# EAGLE schematic ES_Daisy_Seed2_DFM_EVAL_EURO_Rev2 (EAGLE 9.6.2)
Assembly variants: OG_AUDIO_BB

## Sheet 1 of 5
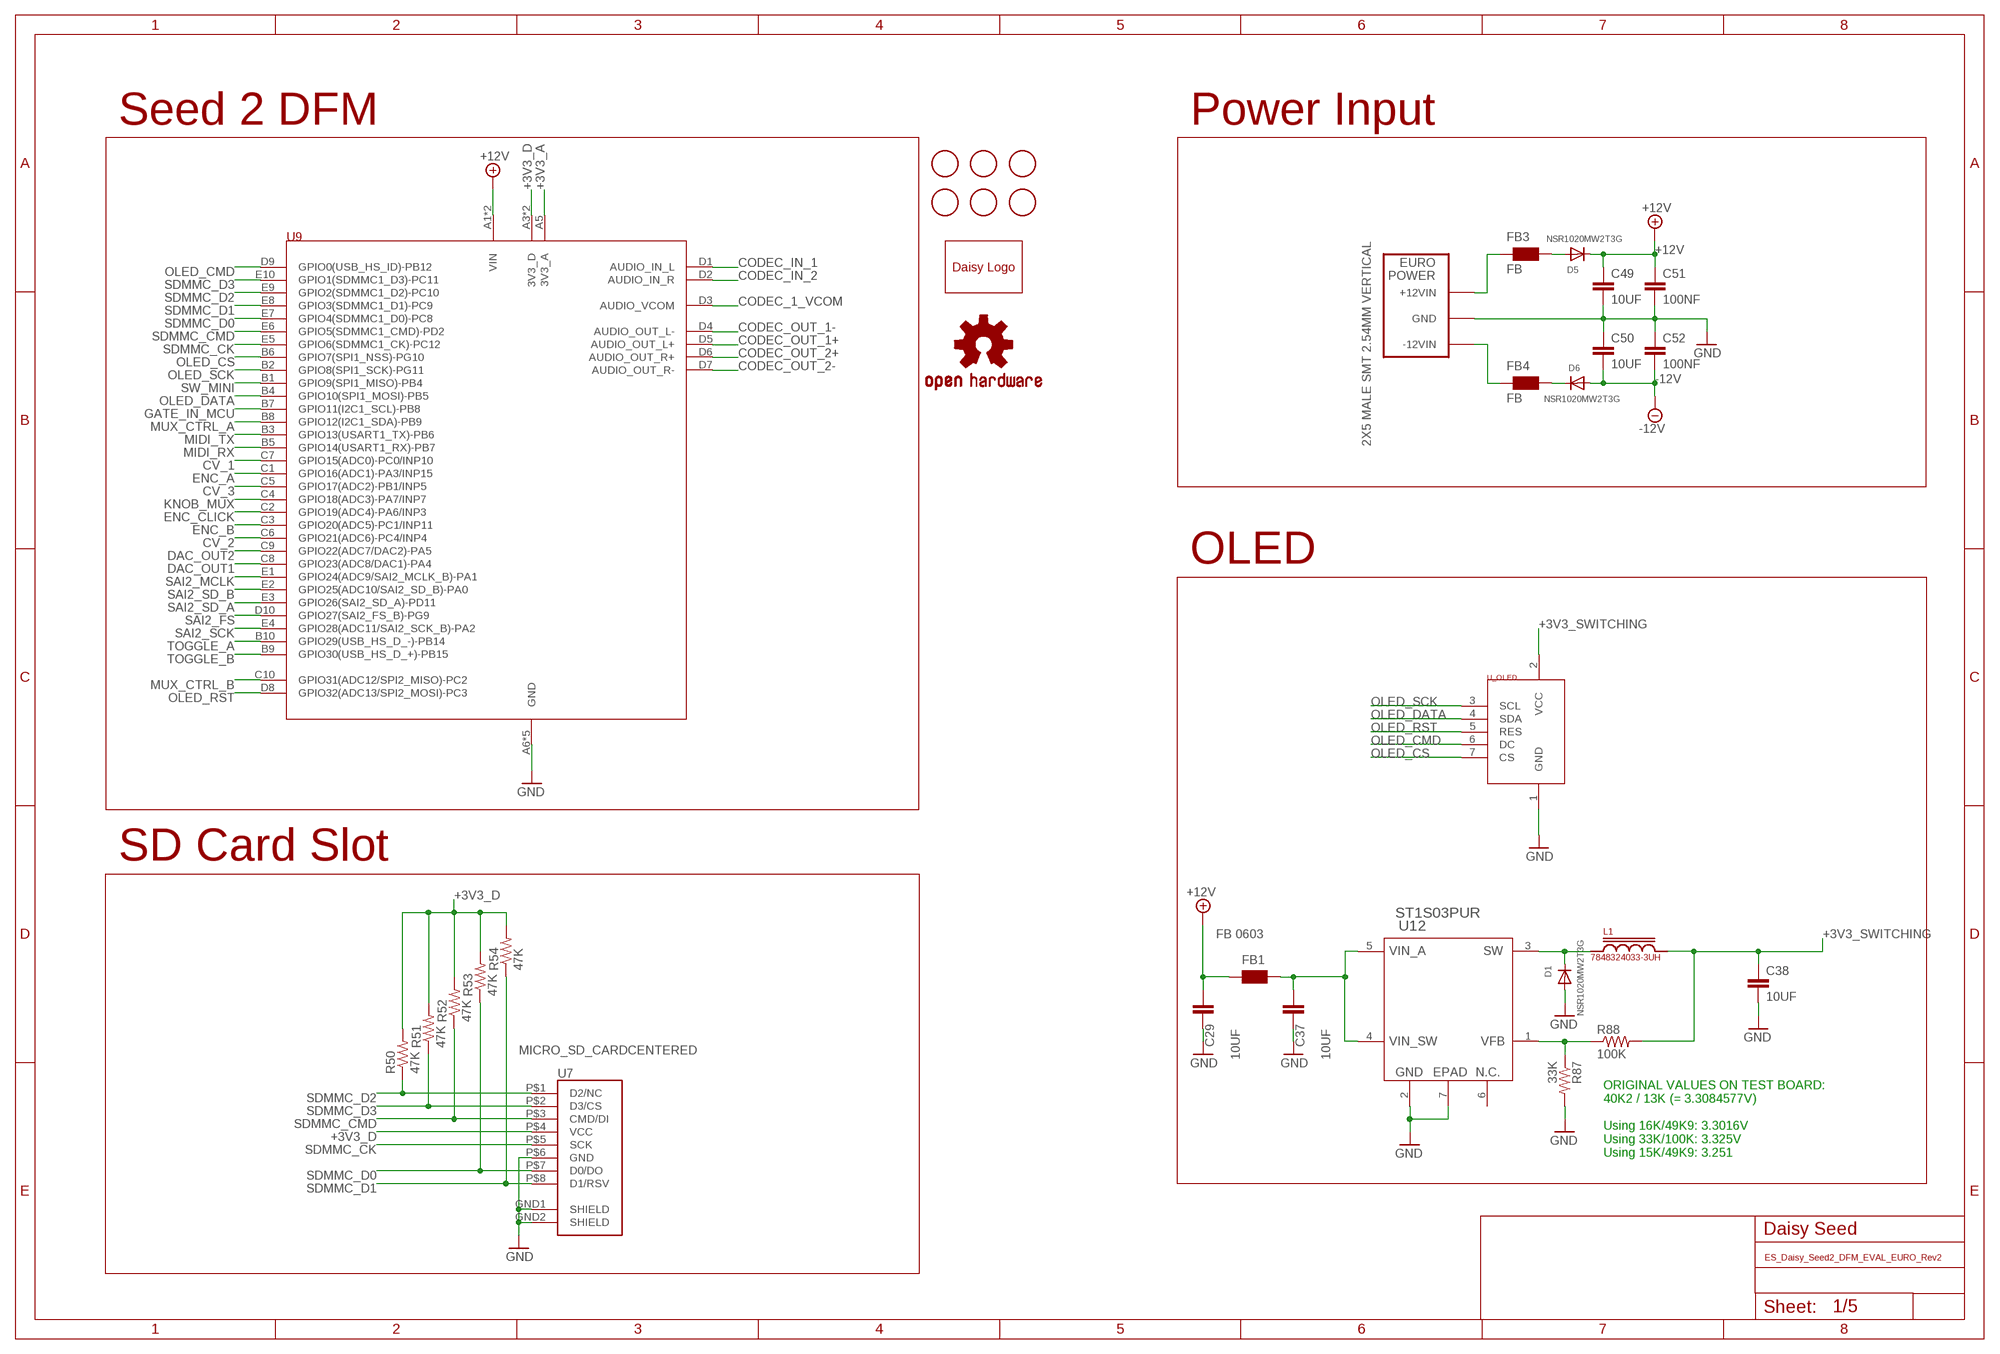
[diagram p0: schematic, sheet 1]

### Parts
C29  10UF  C-EUC0805  [C0805]  (not fitted in variant OG_AUDIO_BB)
C37  10UF  C-EUC0805  [C0805]
C38  10UF  C-EUC0805  [C0805]
C49  10UF  C-EUC0805  [C0805]
C50  10UF  C-EUC0805  [C0805]
C51  100NF  C-EUC0402  [C0402]
C52  100NF  C-EUC0402  [C0402]
D1  NSR1020MW2T3G  DIODE_SOD-323F  [SOD-323F]
D5  NSR1020MW2T3G  DIODE_SOD-323F  [SOD-323F]
D6  NSR1020MW2T3G  DIODE_SOD-323F  [SOD-323F]
FB1  FB 0603  FERRITE_BEAD_0603  [WUERTH-ELEKTRONIK_0603]  (not fitted in variant OG_AUDIO_BB)
FB3  FB  FERRITE_BEAD_0603  [WUERTH-ELEKTRONIK_0603]
FB4  FB  FERRITE_BEAD_0603  [WUERTH-ELEKTRONIK_0603]
FD1  FIDUCIAL  [FIDUCIAL_1MM]
FD2  FIDUCIAL  [FIDUCIAL_1MM]
FD3  FIDUCIAL  [FIDUCIAL_1MM]
FD4  FIDUCIAL  [FIDUCIAL_1MM]
FD5  FIDUCIAL  [FIDUCIAL_1MM]
FD6  FIDUCIAL  [FIDUCIAL_1MM]
L1  7848324033-3UH  INDUCTOR1008  [I1008]
LOGO1  OSHW-LOGO  [OSHW-LOGO-L_TEXT]
P1  2X5 MALE SMT 2.54MM VERTICAL  EURORACK_POWERSMT  [EURORACK_POWER_SMT]
R50  47K  R-US_R0603  [R0603]
R51  47K  R-US_R0603  [R0603]
R52  47K  R-US_R0603  [R0603]
R53  47K  R-US_R0603  [R0603]
R54  47K  R-US_R0603  [R0603]
R87  33K  R-US_R0603  [R0603]
R88  100K  R-US_R0402  [R0402]
U7  MICRO_SD_CARDCENTERED  [VERT_MICROSD_CENTERED]
U9  ES_DAISY_SEED2_DFM_REV1""  [ES_DAISY_SEED2_DFM_REV1]
U12  ST1S03PUR  [DFN06_3X3_STM]
U$5  DAISYLOGO  [ES_DAISY_LOGO_1]
U_OLED  OLED_DISPLAY  [ER-OLEDM015-2]

### Nets
+3V3_A: U9.A5(3V3_A) ; also sheet 2,3
+3V3_D: R50.2 R51.2 R52.2 R53.2 R54.2 U7.P$4(VCC) U9.A3(3V3_D) U9.A4(3V3_D) ; also sheet 2,3,4
+3V3_SWITCHING: C38.1 L1.2 R88.2 U_OLED.2(VCC)
+12V: C29.1 C49.1 C51.1 D5.C FB1.1 U9.A1(VIN) U9.A2(VIN) ; also sheet 3,4
-12V: C50.2 C52.2 D6.A ; also sheet 3,4
CODEC_1_VCOM: U9.D3(AUDIO_VCOM) ; also sheet 5
CODEC_IN_1: U9.D1(AUDIO_IN_L) ; also sheet 5
CODEC_IN_2: U9.D2(AUDIO_IN_R) ; also sheet 5
CODEC_OUT_1+ [CODEC]: U9.D5(AUDIO_OUT_L+) ; also sheet 4
CODEC_OUT_1- [CODEC]: U9.D4(AUDIO_OUT_L-) ; also sheet 4
CODEC_OUT_2+ [CODEC]: U9.D6(AUDIO_OUT_R+) ; also sheet 4
CODEC_OUT_2- [CODEC]: U9.D7(AUDIO_OUT_R-) ; also sheet 4
CV_1: U9.C7(GPIO15(ADC0)-PC0/INP10) ; also sheet 3
CV_2: U9.C6(GPIO21(ADC6)-PC4/INP4) ; also sheet 3
CV_3: U9.C5(GPIO17(ADC2)-PB1/INP5) ; also sheet 3
DAC_OUT1: U9.C8(GPIO23(ADC8/DAC1)-PA4) ; also sheet 3
DAC_OUT2: U9.C9(GPIO22(ADC7/DAC2)-PA5) ; also sheet 3
ENC_A: U9.C1(GPIO16(ADC1)-PA3/INP15) ; also sheet 2
ENC_B: U9.C3(GPIO20(ADC5)-PC1/INP11) ; also sheet 2
ENC_CLICK: U9.C2(GPIO19(ADC4)-PA6/INP3) ; also sheet 2
GATE_IN_MCU: U9.B7(GPIO11(I2C1_SCL)-PB8) ; also sheet 3
GND: C29.2 C37.2 C38.2 C49.2 C50.1 C51.2 C52.1 D1.A P1.GND1A(GND) P1.GND1B(GND) P1.GND2A(GND) P1.GND2B(GND) P1.GND3A(GND) P1.GND3B(GND) R87.2 U7.GND1(SHIELD) U7.GND2(SHIELD) U7.P$6(GND) U9.A6(GND) U9.A7(GND) U9.A8(GND) U9.A9(GND) U9.A10(GND) U12.2(GND) U12.7(EPAD) U_OLED.1(GND) ; also sheet 2,3,4,5
KNOB_MUX: U9.C4(GPIO18(ADC3)-PA7/INP7) ; also sheet 3
MIDI_RX: U9.B5(GPIO14(USART1_RX)-PB7) ; also sheet 3
MIDI_TX: U9.B3(GPIO13(USART1_TX)-PB6) ; also sheet 2
MUX_CTRL_A: U9.B8(GPIO12(I2C1_SDA)-PB9) ; also sheet 3
MUX_CTRL_B: U9.C10(GPIO31(ADC12/SPI2_MISO)-PC2) ; also sheet 3
N$51: R87.1 R88.1 U12.1(VFB)
N$55: FB3.1 P1.P12VA(+12VIN) P1.P12VB(+12VIN)
N$59: D5.A FB3.2
N$63: D6.C FB4.2
N$67: FB4.1 P1.N12VA(-12VIN) P1.N12VB(-12VIN)
N$68: D1.C L1.1 U12.3(SW)
N$69: C37.1 FB1.2 U12.4(VIN_SW) U12.5(VIN_A)
OLED_CMD: U9.D9(GPIO0(USB_HS_ID)-PB12) U_OLED.6(DC)
OLED_CS: U9.B6(GPIO7(SPI1_NSS)-PG10) U_OLED.7(CS)
OLED_DATA: U9.B4(GPIO10(SPI1_MOSI)-PB5) U_OLED.4(SDA)
OLED_RST: U9.D8(GPIO32(ADC13/SPI2_MOSI)-PC3) U_OLED.5(RES)
OLED_SCK: U9.B2(GPIO8(SPI1_SCK)-PG11) U_OLED.3(SCL)
SAI2_FS [SAI]: U9.D10(GPIO27(SAI2_FS_B)-PG9) ; also sheet 4
SAI2_MCLK [SAI]: U9.E1(GPIO24(ADC9/SAI2_MCLK_B)-PA1) ; also sheet 4
SAI2_SCK [SAI]: U9.E4(GPIO28(ADC11/SAI2_SCK_B)-PA2) ; also sheet 4
SAI2_SD_A [SAI]: U9.E3(GPIO26(SAI2_SD_A)-PD11) ; also sheet 4
SAI2_SD_B: U9.E2(GPIO25(ADC10/SAI2_SD_B)-PA0) ; also sheet 4
SDMMC_CK: U7.P$5(SCK) U9.E5(GPIO6(SDMMC1_CK)-PC12)
SDMMC_CMD: R52.1 U7.P$3(CMD/DI) U9.E6(GPIO5(SDMMC1_CMD)-PD2)
SDMMC_D0: R53.1 U7.P$7(D0/DO) U9.E7(GPIO4(SDMMC1_D0)-PC8)
SDMMC_D1: R54.1 U7.P$8(D1/RSV) U9.E8(GPIO3(SDMMC1_D1)-PC9)
SDMMC_D2: R50.1 U7.P$1(D2/NC) U9.E9(GPIO2(SDMMC1_D2)-PC10)
SDMMC_D3: R51.1 U7.P$2(D3/CS) U9.E10(GPIO1(SDMMC1_D3)-PC11)
SW_MINI: U9.B1(GPIO9(SPI1_MISO)-PB4) ; also sheet 2
TOGGLE_A: U9.B10(GPIO29(USB_HS_D_-)-PB14) ; also sheet 2
TOGGLE_B: U9.B9(GPIO30(USB_HS_D_+)-PB15) ; also sheet 2
Unconnected: U12.6(N.C.)

### Notes on the sheet
- Seed 2 DFM | Power Input
- OLED
- SD Card Slot
- ORIGINAL VALUES ON TEST BOARD:
  40K2 / 13K (= 3.3084577V)
  
  Using 16K/49K9: 3.3016V
  Using 33K/100K: 3.325V
  Using 15K/49K9: 3.251
- Daisy Seed

## Sheet 2 of 5
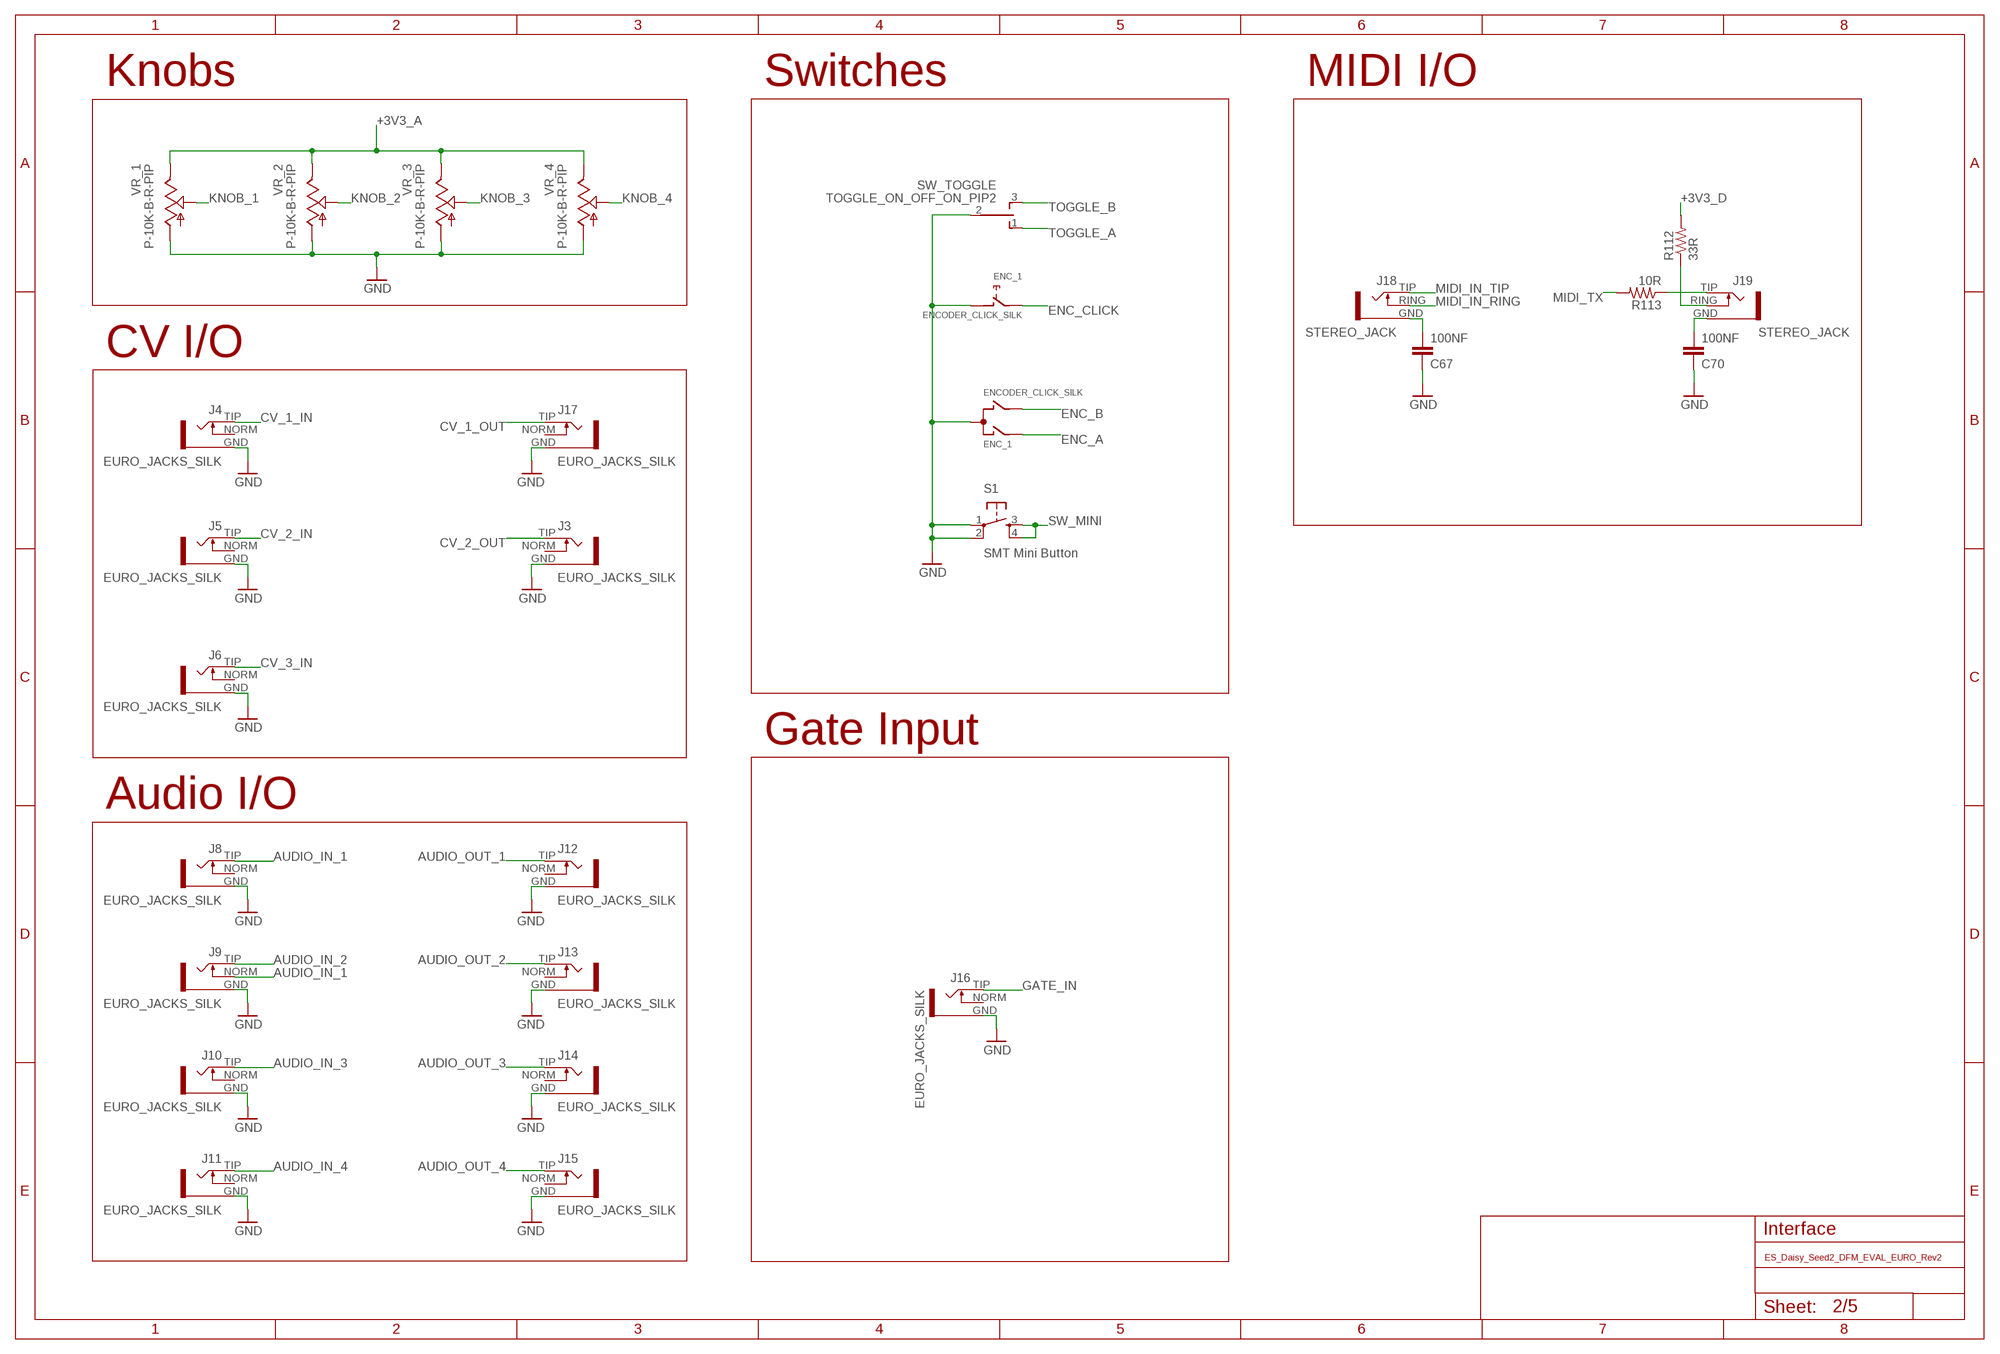
[diagram p1: schematic, sheet 2]

### Parts
C67  100NF  C-EUC0402  [C0402]
C70  100NF  C-EUC0402  [C0402]
ENC_1  ENCODER_CLICK_SILK  [PEC11_SILK]
J3  EURO_JACKS_SILK  [S_JACK_SILK]
J4  EURO_JACKS_SILK  [S_JACK_SILK]
J5  EURO_JACKS_SILK  [S_JACK_SILK]
J6  EURO_JACKS_SILK  [S_JACK_SILK]
J8  EURO_JACKS_SILK  [S_JACK_SILK]
J9  EURO_JACKS_SILK  [S_JACK_SILK]
J10  EURO_JACKS_SILK  [S_JACK_SILK]
J11  EURO_JACKS_SILK  [S_JACK_SILK]
J12  EURO_JACKS_SILK  [S_JACK_SILK]
J13  EURO_JACKS_SILK  [S_JACK_SILK]
J14  EURO_JACKS_SILK  [S_JACK_SILK]
J15  EURO_JACKS_SILK  [S_JACK_SILK]
J16  EURO_JACKS_SILK  [S_JACK_SILK]
J17  EURO_JACKS_SILK  [S_JACK_SILK]
J18  STEREO_JACK  [STEREO_JACK_3.5MM]
J19  STEREO_JACK  [STEREO_JACK_3.5MM]
R112  33R  R-US_R0603  [R0603]
R113  10R  R-US_R0603  [R0603]
S1  SMT Mini Button  TAC_SWITCH_SMT  [TL3301SPF160QJ]
SW_TOGGLE  TOGGLE_ON_OFF_ON_PIP2  [TOGGLE_SILK_PIP3]
VR_1  P-10K-B-R-PIP  POT_9MM_SNAP-IN__SILK_PIP  [9MM_SNAP-IN_POT_SILK_PIP]
VR_2  P-10K-B-R-PIP  POT_9MM_SNAP-IN__SILK_PIP  [9MM_SNAP-IN_POT_SILK_PIP]
VR_3  P-10K-B-R-PIP  POT_9MM_SNAP-IN__SILK_PIP  [9MM_SNAP-IN_POT_SILK_PIP]
VR_4  P-10K-B-R-PIP  POT_9MM_SNAP-IN__SILK_PIP  [9MM_SNAP-IN_POT_SILK_PIP]

### Nets
+3V3_A: VR_1.3 VR_2.3 VR_3.3 VR_4.3 ; also sheet 1,3
+3V3_D: R112.2 ; also sheet 1,3,4
AUDIO_IN_1: J8.TIP J9.NORM ; also sheet 5
AUDIO_IN_2: J9.TIP ; also sheet 5
AUDIO_IN_3: J10.TIP ; also sheet 5
AUDIO_IN_4: J11.TIP ; also sheet 5
AUDIO_OUT_1: J12.TIP ; also sheet 4
AUDIO_OUT_2: J13.TIP ; also sheet 4
AUDIO_OUT_3: J14.TIP ; also sheet 4
AUDIO_OUT_4: J15.TIP ; also sheet 4
CV_1_IN: J4.TIP ; also sheet 3
CV_1_OUT: J17.TIP ; also sheet 3
CV_2_IN: J5.TIP ; also sheet 3
CV_2_OUT: J3.TIP ; also sheet 3
CV_3_IN: J6.TIP ; also sheet 3
ENC_A: ENC_1.A ; also sheet 1
ENC_B: ENC_1.B ; also sheet 1
ENC_CLICK: ENC_1.E ; also sheet 1
GATE_IN: J16.TIP ; also sheet 3
GND: C67.1 C70.1 ENC_1.C ENC_1.D J3.GND J4.GND J5.GND J6.GND J8.GND J9.GND J10.GND J11.GND J12.GND J13.GND J14.GND J15.GND J16.GND J17.GND S1.1 S1.2 SW_TOGGLE.2(P) VR_1.1 VR_2.1 VR_3.1 VR_4.1 ; also sheet 1,3,4,5
KNOB_1: VR_1.2 ; also sheet 3
KNOB_2: VR_2.2 ; also sheet 3
KNOB_3: VR_3.2 ; also sheet 3
KNOB_4: VR_4.2 ; also sheet 3
MIDI_IN_RING: J18.RING(NORM) ; also sheet 3
MIDI_IN_TIP: J18.TIP ; also sheet 3
MIDI_TX: R113.2 ; also sheet 1
N$75: J19.RING(NORM) R112.1
N$76: J19.TIP R113.1
N$77: C67.2 J18.GND
N$78: C70.2 J19.GND
SW_MINI: S1.3 S1.4 ; also sheet 1
TOGGLE_A: SW_TOGGLE.1(O) ; also sheet 1
TOGGLE_B: SW_TOGGLE.3(S) ; also sheet 1
Unconnected: ENC_1.GND1(G) ENC_1.GND2(G) J3.NORM J4.NORM J5.NORM J6.NORM J8.NORM J10.NORM J11.NORM J12.NORM J13.NORM J14.NORM J15.NORM J16.NORM J17.NORM

### Notes on the sheet
- Knobs | Switches | MIDI I/O
- CV I/O
- Gate Input
- Audio I/O
- Interface

## Sheet 3 of 5
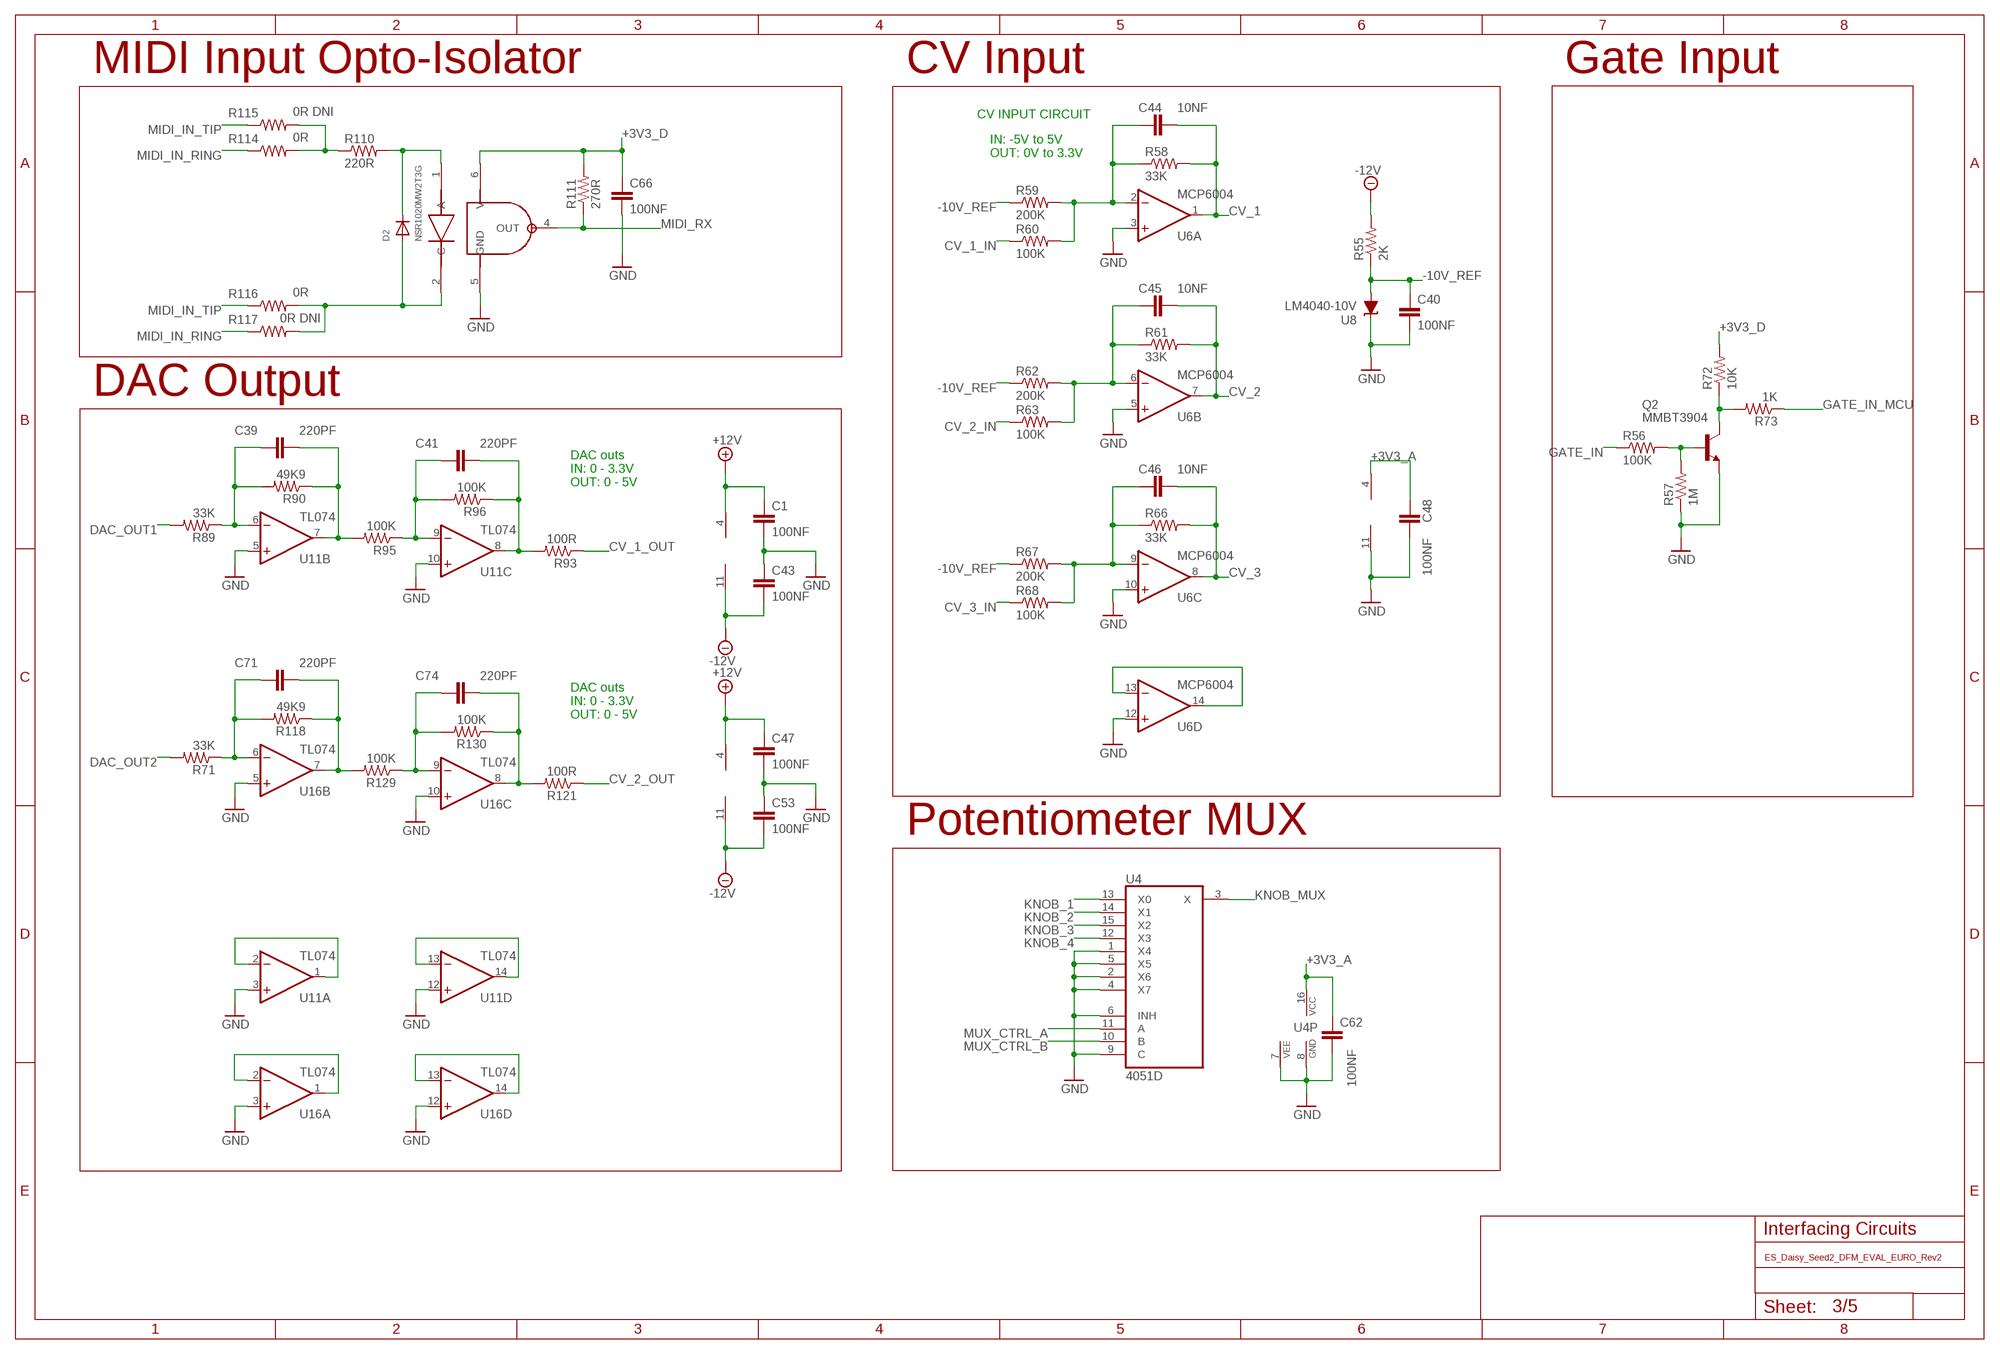
[diagram p2: schematic, sheet 3]

### Parts
C1  100NF  C-EUC0402  [C0402]
C39  220PF  C-EUC0603  [C0603]
C40  100NF  C-EUC0402  [C0402]
C41  220PF  C-EUC0603  [C0603]
C43  100NF  C-EUC0402  [C0402]
C44  10NF  C-EUC0603  [C0603]
C45  10NF  C-EUC0603  [C0603]
C46  10NF  C-EUC0603  [C0603]
C47  100NF  C-EUC0402  [C0402]
C48  100NF  C-EUC0402  [C0402]
C53  100NF  C-EUC0402  [C0402]
C62  100NF  C-EUC0402  [C0402]
C66  100NF  C-EUC0402  [C0402]
C71  220PF  C-EUC0603  [C0603]
C74  220PF  C-EUC0603  [C0603]
D2  NSR1020MW2T3G  DIODE_SOD-323F  [SOD-323F]
Q2  MMBT3904  NPNSOT23-BEC  [SOT23-BEC]
R55  2K  R-US_R0603  [R0603]
R56  100K  R-US_R0402  [R0402]
R57  1M  R-US_R0603  [R0603]
R58  33K  R-US_R0603  [R0603]
R59  200K  R-US_R0603  [R0603]
R60  100K  R-US_R0402  [R0402]
R61  33K  R-US_R0603  [R0603]
R62  200K  R-US_R0603  [R0603]
R63  100K  R-US_R0402  [R0402]
R66  33K  R-US_R0603  [R0603]
R67  200K  R-US_R0603  [R0603]
R68  100K  R-US_R0402  [R0402]
R71  33K  R-US_R0603  [R0603]
R72  10K  R-US_R0603  [R0603]
R73  1K  R-US_R0402  [R0402]
R89  33K  R-US_R0603  [R0603]
R90  49K9  R-US_R0603  [R0603]
R93  100R  R-US_R0603  [R0603]
R95  100K  R-US_R0402  [R0402]
R96  100K  R-US_R0402  [R0402]
R110  220R  R-US_R0603  [R0603]
R111  270R  R-US_R0603  [R0603]
R114  0R  R-US_R0603  [R0603]
R115  0R DNI  R-US_R0603  [R0603]
R116  0R  R-US_R0603  [R0603]
R117  0R DNI  R-US_R0603  [R0603]
R118  49K9  R-US_R0603  [R0603]
R121  100R  R-US_R0603  [R0603]
R129  100K  R-US_R0402  [R0402]
R130  100K  R-US_R0402  [R0402]
U4  4051D  [SO-16]
U6  MCP6004  MCP6004_TSSOP-14  [TSSOP-14]
U8  LM4040-10V  LM4040-10VA12DBZ  [DBZ_R-PDSO-G3]
U11  TL074  TL074_TSSOP-14  [TSSOP-14]
U15  OPTOISOLATOR_H11L1M  [DIL06_GULLWING]
U16  TL074  TL074_TSSOP-14  [TSSOP-14]

### Nets
+3V3_A: C48.1 C62.1 U4.16(VCC) U6.4(P:V+) ; also sheet 1,2
+3V3_D: C66.1 R72.2 R111.2 U15.6(V) ; also sheet 1,2,4
+12V: C1.1 C47.1 U11.4(P:V+) U16.4(P:V+) ; also sheet 1,4
-10V_REF: C40.1 R55.1 R59.1 R62.1 R67.1 U8.2(A)
-12V: C43.2 C53.2 R55.2 U11.11(P:V-) U16.11(P:V-) ; also sheet 1,4
CV_1: C44.2 R58.2 U6.1(A:OUT) ; also sheet 1
CV_1_IN: R60.1 ; also sheet 2
CV_1_OUT: R93.1 ; also sheet 2
CV_2: C45.2 R61.2 U6.7(B:OUT) ; also sheet 1
CV_2_IN: R63.1 ; also sheet 2
CV_2_OUT: R121.1 ; also sheet 2
CV_3: C46.2 R66.2 U6.8(C:OUT) ; also sheet 1
CV_3_IN: R68.1 ; also sheet 2
DAC_OUT1: R89.2 ; also sheet 1
DAC_OUT2: R71.2 ; also sheet 1
GATE_IN: R56.1 ; also sheet 2
GATE_IN_MCU: R73.1 ; also sheet 1
GND: C1.2 C40.2 C43.1 C47.2 C48.2 C53.1 C62.2 C66.2 Q2.E R57.1 U4.1(X4) U4.2(X6) U4.4(X7) U4.5(X5) U4.6(INH) U4.7(VEE) U4.8(GND) U4.9(C) U6.3(A:+IN) U6.5(B:+IN) U6.10(C:+IN) U6.11(P:V-) U6.12(D:+IN) U8.1(C) U11.3(A:+IN) U11.5(B:+IN) U11.10(C:+IN) U11.12(D:+IN) U15.5(GND) U16.3(A:+IN) U16.5(B:+IN) U16.10(C:+IN) U16.12(D:+IN) ; also sheet 1,2,4,5
KNOB_1: U4.13(X0) ; also sheet 2
KNOB_2: U4.14(X1) ; also sheet 2
KNOB_3: U4.15(X2) ; also sheet 2
KNOB_4: U4.12(X3) ; also sheet 2
KNOB_MUX: U4.3(X) ; also sheet 1
MIDI_IN_RING: R114.1 R117.1 ; also sheet 2
MIDI_IN_TIP: R115.1 R116.1 ; also sheet 2
MIDI_RX: R111.1 U15.4(OUT) ; also sheet 1
MUX_CTRL_A: U4.11(A) ; also sheet 1
MUX_CTRL_B: U4.10(B) ; also sheet 1
N$9: U16.1(A:OUT) U16.2(A:-IN)
N$14: U11.13(D:-IN) U11.14(D:OUT)
N$34: C39.1 R89.1 R90.2 U11.6(B:-IN)
N$35: U16.13(D:-IN) U16.14(D:OUT)
N$36: U6.13(D:-IN) U6.14(D:OUT)
N$37: U11.1(A:OUT) U11.2(A:-IN)
N$39: Q2.B R56.2 R57.2
N$40: Q2.C R72.1 R73.2
N$49: C39.2 R90.1 R95.2 U11.7(B:OUT)
N$54: C44.1 R58.1 R59.2 R60.2 U6.2(A:-IN)
N$58: C45.1 R61.1 R62.2 R63.2 U6.6(B:-IN)
N$62: C46.1 R66.1 R67.2 R68.2 U6.9(C:-IN)
N$71: C41.1 R95.1 R96.2 U11.9(C:-IN)
N$72: C41.2 R93.2 R96.1 U11.8(C:OUT)
N$74: D2.C R110.2 U15.1(A)
N$79: D2.A R116.2 R117.2 U15.2(C)
N$80: R110.1 R114.2 R115.2
N$81: C71.1 R71.1 R118.2 U16.6(B:-IN)
N$82: C71.2 R118.1 R129.2 U16.7(B:OUT)
N$85: C74.1 R129.1 R130.2 U16.9(C:-IN)
N$86: C74.2 R121.2 R130.1 U16.8(C:OUT)

### Notes on the sheet
- MIDI Input Opto-Isolator | CV Input | Gate Input
- CV INPUT CIRCUIT
- IN: -5V to 5V
  OUT: 0V to 3.3V
- DAC Output
- DAC outs
  IN: 0 - 3.3V
  OUT: 0 - 5V
- DAC outs
  IN: 0 - 3.3V
  OUT: 0 - 5V
- Potentiometer MUX
- Interfacing Circuits

## Sheet 4 of 5
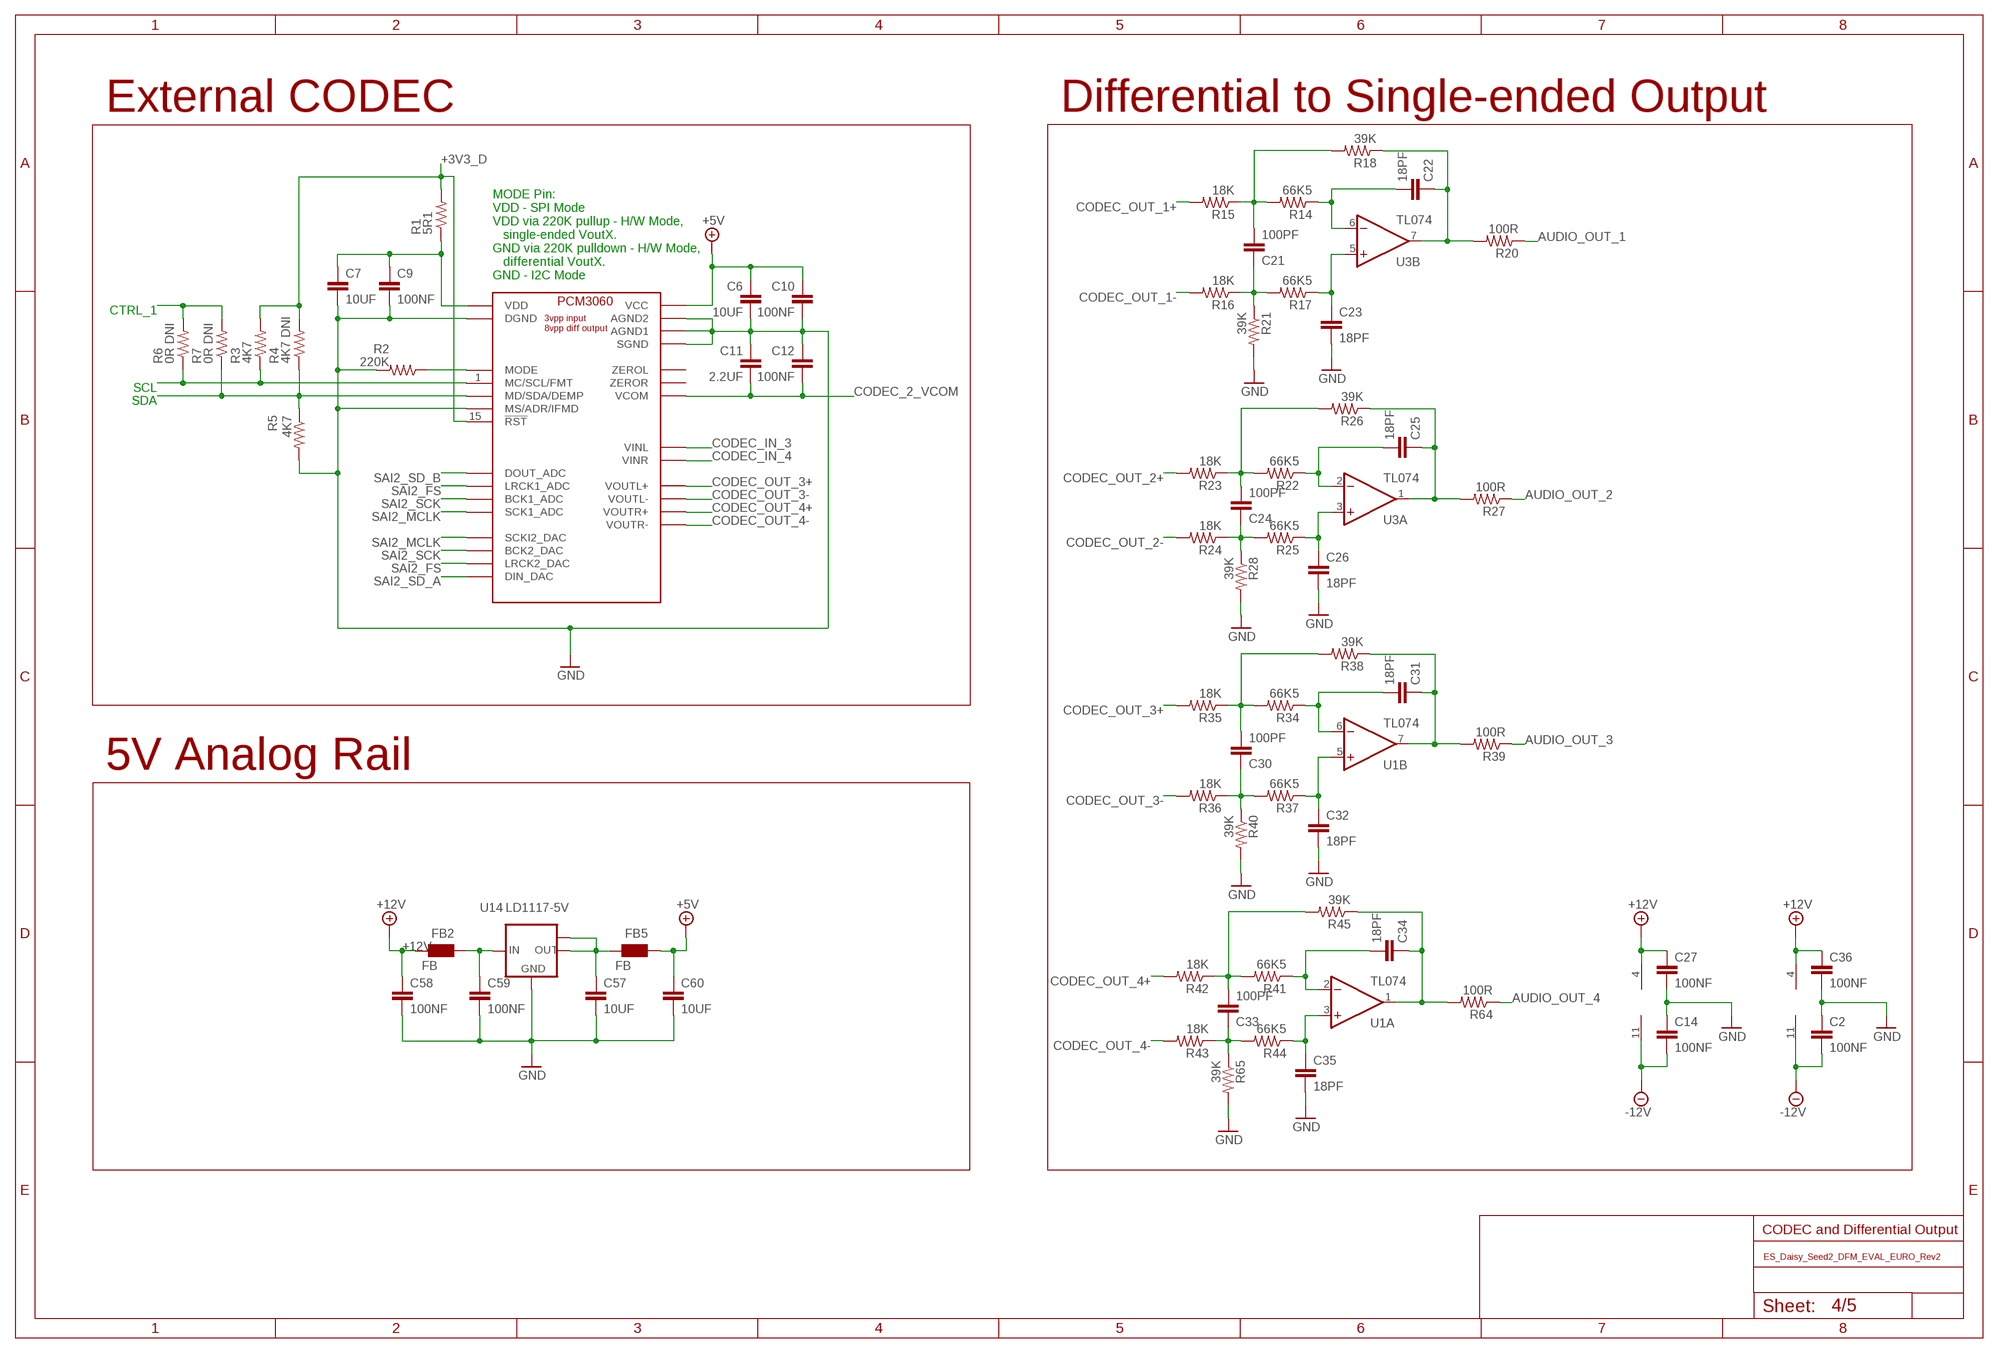
[diagram p3: schematic, sheet 4]

### Parts
C2  100NF  C-EUC0402  [C0402]
C6  10UF  C-EUC0805  [C0805]
C7  10UF  C-EUC0805  [C0805]
C9  100NF  C-EUC0402  [C0402]
C10  100NF  C-EUC0402  [C0402]
C11  2.2UF  C-EUC0603  [C0603]
C12  100NF  C-EUC0402  [C0402]
C14  100NF  C-EUC0402  [C0402]
C21  100PF  C-EUC0603  [C0603]
C22  18PF  C-EUC0603  [C0603]
C23  18PF  C-EUC0603  [C0603]
C24  100PF  C-EUC0603  [C0603]
C25  18PF  C-EUC0603  [C0603]
C26  18PF  C-EUC0603  [C0603]
C27  100NF  C-EUC0402  [C0402]
C30  100PF  C-EUC0603  [C0603]
C31  18PF  C-EUC0603  [C0603]
C32  18PF  C-EUC0603  [C0603]
C33  100PF  C-EUC0603  [C0603]
C34  18PF  C-EUC0603  [C0603]
C35  18PF  C-EUC0603  [C0603]
C36  100NF  C-EUC0402  [C0402]
C57  10UF  C-EUC0805  [C0805]
C58  100NF  C-EUC0402  [C0402]
C59  100NF  C-EUC0402  [C0402]
C60  10UF  C-EUC0805  [C0805]
FB2  FB  FERRITE_BEAD_0603  [WUERTH-ELEKTRONIK_0603]
FB5  FB  FERRITE_BEAD_0603  [WUERTH-ELEKTRONIK_0603]
R1  5R1  R-US_R0603  [R0603]
R2  220K  R-US_R0603  [R0603]
R3  4K7  R-US_R0603  [R0603]
R4  4K7 DNI  R-US_R0603  [R0603]
R5  4K7  R-US_R0603  [R0603]
R6  0R DNI  R-US_R0603  [R0603]
R7  0R DNI  R-US_R0603  [R0603]
R14  66K5  R-US_R0603  [R0603]
R15  18K  R-US_R0603  [R0603]
R16  18K  R-US_R0603  [R0603]
R17  66K5  R-US_R0603  [R0603]
R18  39K  R-US_R0603  [R0603]
R20  100R  R-US_R0603  [R0603]
R21  39K  R-US_R0603  [R0603]
R22  66K5  R-US_R0603  [R0603]
R23  18K  R-US_R0603  [R0603]
R24  18K  R-US_R0603  [R0603]
R25  66K5  R-US_R0603  [R0603]
R26  39K  R-US_R0603  [R0603]
R27  100R  R-US_R0603  [R0603]
R28  39K  R-US_R0603  [R0603]
R34  66K5  R-US_R0603  [R0603]
R35  18K  R-US_R0603  [R0603]
R36  18K  R-US_R0603  [R0603]
R37  66K5  R-US_R0603  [R0603]
R38  39K  R-US_R0603  [R0603]
R39  100R  R-US_R0603  [R0603]
R40  39K  R-US_R0603  [R0603]
R41  66K5  R-US_R0603  [R0603]
R42  18K  R-US_R0603  [R0603]
R43  18K  R-US_R0603  [R0603]
R44  66K5  R-US_R0603  [R0603]
R45  39K  R-US_R0603  [R0603]
R64  100R  R-US_R0603  [R0603]
R65  39K  R-US_R0603  [R0603]
U1  TL074  TL074_TSSOP-14  [TSSOP-14]
U2  PCM3060  PCM3060PWR  [TSSOP-28]
U3  TL074  TL074_TSSOP-14  [TSSOP-14]
U14  LD1117-5V  [SOT223]

### Nets
+3V3_D: R1.2 R3.2 R4.2 U2.15(!RST) ; also sheet 1,2,3
+5V: C6.1 C10.1 C60.1 FB5.2 U2.24(VCC)
+12V: C27.1 C36.1 C58.1 FB2.1 U1.4(P:V+) U3.4(P:V+) ; also sheet 1,3
-12V: C2.2 C14.2 U1.11(P:V-) U3.11(P:V-) ; also sheet 1,3
AUDIO_OUT_1: R20.1 ; also sheet 2
AUDIO_OUT_2: R27.1 ; also sheet 2
AUDIO_OUT_3: R39.1 ; also sheet 2
AUDIO_OUT_4: R64.1 ; also sheet 2
CODEC_2_VCOM: C11.1 C12.1 U2.21(VCOM) ; also sheet 5
CODEC_IN_3: U2.25(VINL) ; also sheet 5
CODEC_IN_4: U2.26(VINR) ; also sheet 5
CODEC_OUT_1+ [CODEC]: R15.2 ; also sheet 1
CODEC_OUT_1- [CODEC]: R16.2 ; also sheet 1
CODEC_OUT_2+ [CODEC]: R23.2 ; also sheet 1
CODEC_OUT_2- [CODEC]: R24.2 ; also sheet 1
CODEC_OUT_3+: R35.2 U2.20(VOUTL+)
CODEC_OUT_3-: R36.2 U2.19(VOUTL-)
CODEC_OUT_4+: R42.2 U2.18(VOUTR+)
CODEC_OUT_4-: R43.2 U2.17(VOUTR-)
GND: C2.1 C6.2 C7.2 C9.2 C10.2 C11.2 C12.2 C14.1 C23.2 C26.2 C27.2 C32.2 C35.2 C36.2 C57.2 C58.2 C59.2 C60.2 R2.2 R5.2 R21.2 R28.2 R40.2 R65.2 U2.8(DGND) U2.16(SGND) U2.22(AGND2) U2.23(AGND1) U2.27(MS/ADR/IFMD) U14.1(GND) ; also sheet 1,2,3,5
HEADPHONE_IN_L1: C22.1 R18.1 R20.2 U3.7(B:OUT)
HEADPHONE_IN_L2: C31.1 R38.1 R39.2 U1.7(B:OUT)
HEADPHONE_IN_R1: C25.1 R26.1 R27.2 U3.1(A:OUT)
HEADPHONE_IN_R2: C34.1 R45.1 R64.2 U1.1(A:OUT)
I2C2_SDA1 [DATA]: R4.1 R5.1 R7.1 U2.2(MD/SDA/DEMP)
N$6: C31.2 R34.1 U1.6(B:-IN)
N$7: C32.1 R37.1 U1.5(B:+IN)
N$8: R2.1 U2.28(MODE)
N$10: R3.1 R6.1 U2.1(MC/SCL/FMT)
N$11: R6.2 R7.2
N$20: C22.2 R14.1 U3.6(B:-IN)
N$21: C23.1 R17.1 U3.5(B:+IN)
N$22: C21.1 R16.1 R17.2 R21.1
N$23: C21.2 R14.2 R15.1 R18.2
N$24: C25.2 R22.1 U3.2(A:-IN)
N$25: C26.1 R25.1 U3.3(A:+IN)
N$26: C24.1 R24.1 R25.2 R28.1
N$27: C24.2 R22.2 R23.1 R26.2
N$28: C30.1 R36.1 R37.2 R40.1
N$29: C30.2 R34.2 R35.1 R38.2
N$30: C34.2 R41.1 U1.2(A:-IN)
N$31: C35.1 R44.1 U1.3(A:+IN)
N$32: C33.1 R43.1 R44.2 R65.1
N$33: C33.2 R41.2 R42.1 R45.2
PCM3060_3V1: C7.1 C9.1 R1.1 U2.7(VDD)
SAI2_FS [SAI]: U2.4(LRCK1_ADC) U2.11(LRCK2_DAC) ; also sheet 1
SAI2_MCLK [SAI]: U2.6(SCK1_ADC) U2.9(SCKI2_DAC) ; also sheet 1
SAI2_SCK [SAI]: U2.5(BCK1_ADC) U2.10(BCK2_DAC) ; also sheet 1
SAI2_SD_A [SAI]: U2.12(DIN_DAC) ; also sheet 1
SAI2_SD_B: U2.3(DOUT_ADC) ; also sheet 1
V_REG_1: C59.1 FB2.2 U14.3(IN)
V_REG_2: C57.1 FB5.1 U14.2(OUT) U14.TAB(OUT1)
Unconnected: U2.13(ZEROR) U2.14(ZEROL)

### Notes on the sheet
- External CODEC | Differential to Single-ended Output
- MODE Pin:
  VDD - SPI Mode
  VDD via 220K pullup - H/W Mode,
     single-ended VoutX.
  GND via 220K pulldown - H/W Mode, 
     differential VoutX.
  GND - I2C Mode
- CTRL_1
- SCL
- SDA
- 5V Analog Rail
- CODEC and Differential Output

## Sheet 5 of 5
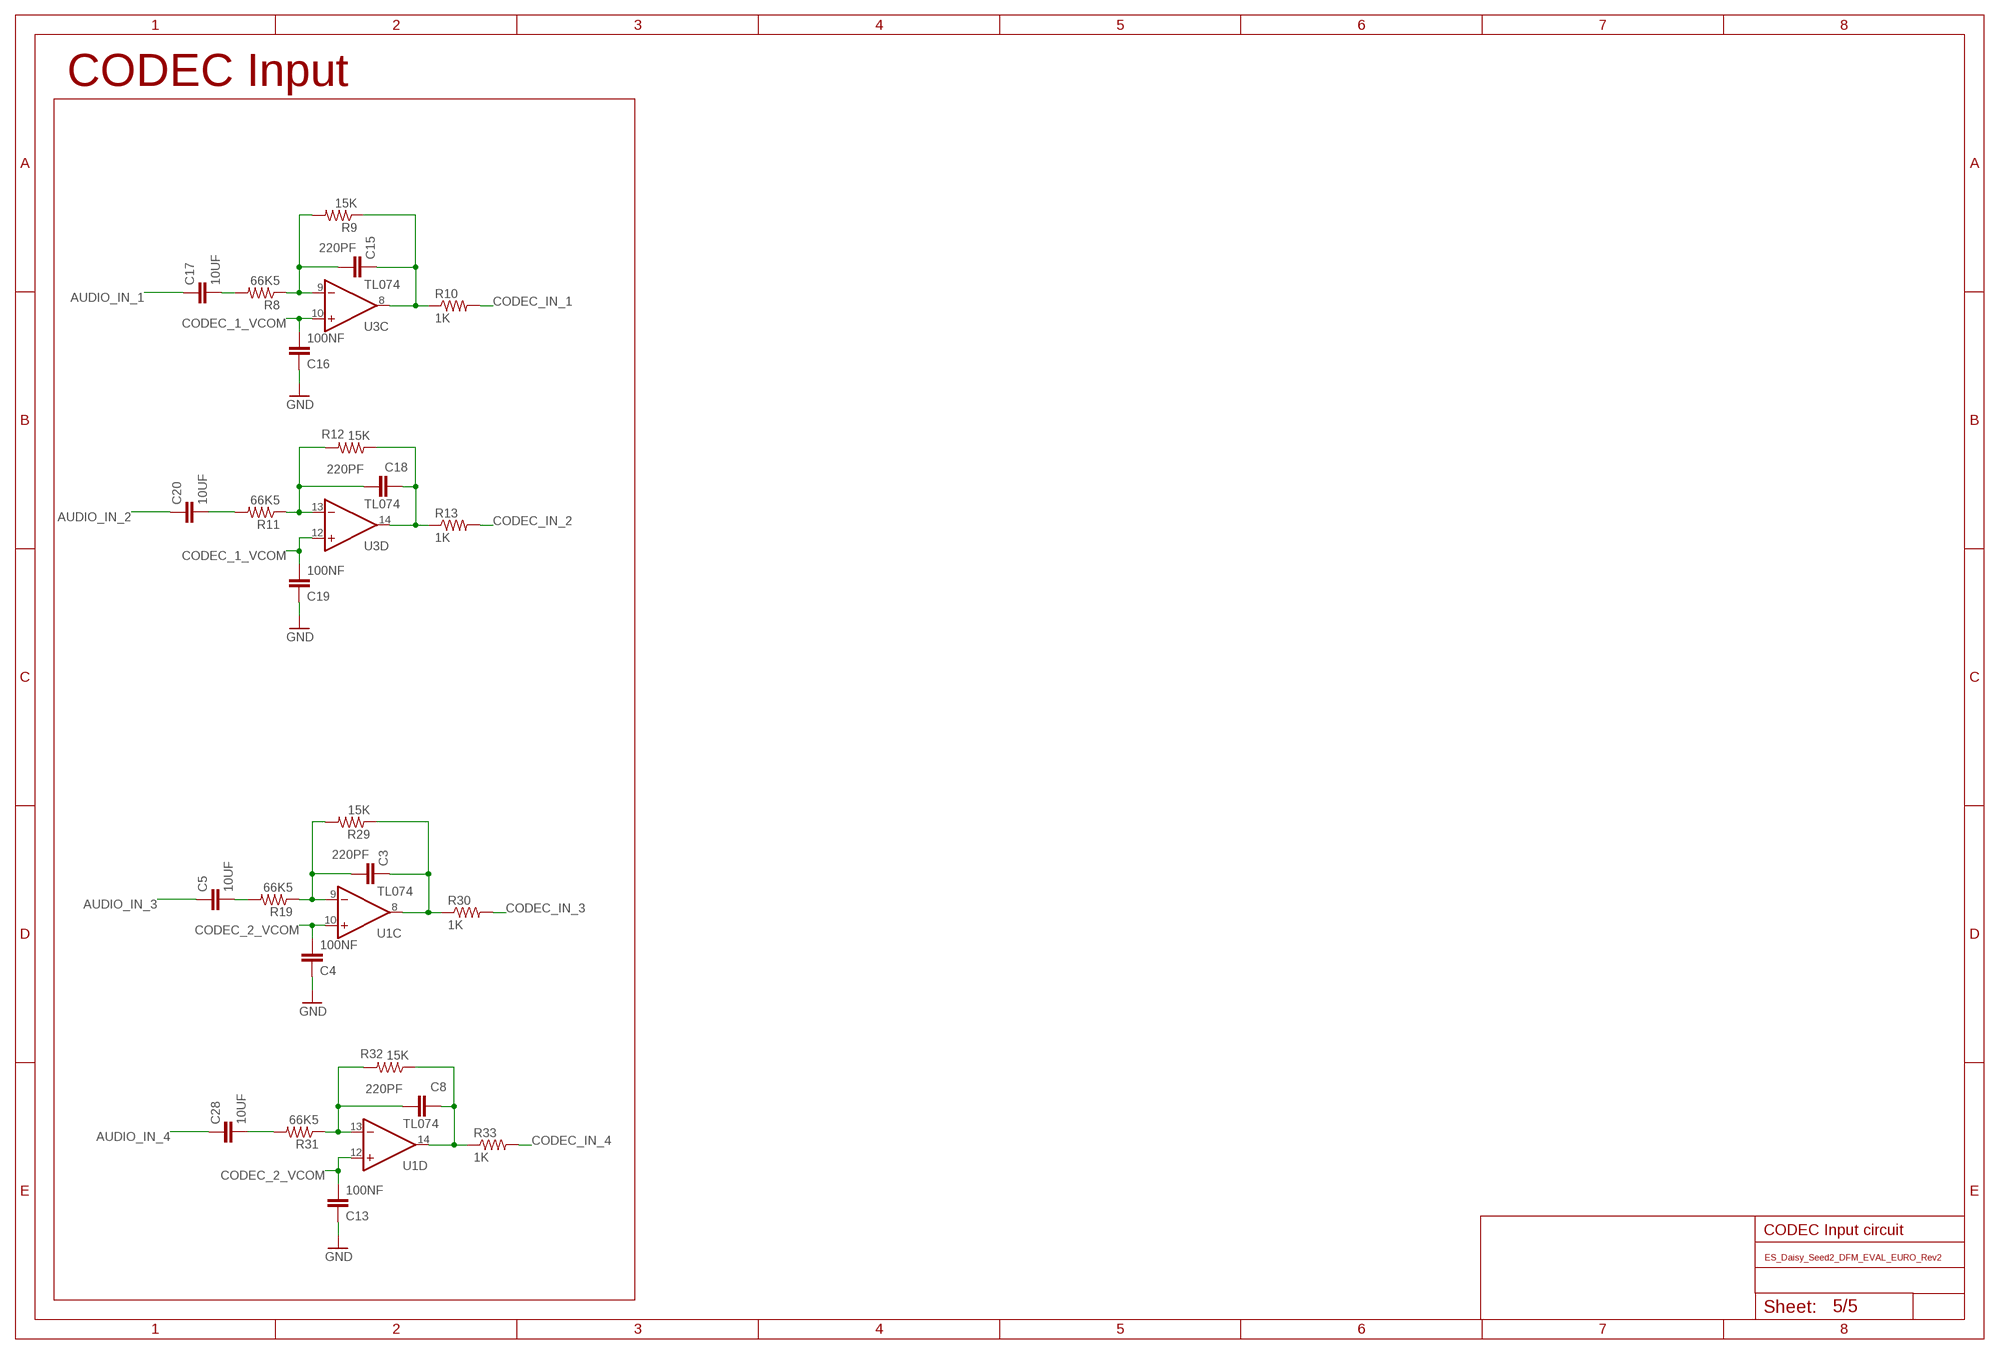
[diagram p4: schematic, sheet 5]

### Parts
C3  220PF  C-EUC0603  [C0603]
C4  100NF  C-EUC0402  [C0402]
C5  10UF  C-EUC0805  [C0805]
C8  220PF  C-EUC0603  [C0603]
C13  100NF  C-EUC0402  [C0402]
C15  220PF  C-EUC0603  [C0603]
C16  100NF  C-EUC0402  [C0402]
C17  10UF  C-EUC0805  [C0805]
C18  220PF  C-EUC0603  [C0603]
C19  100NF  C-EUC0402  [C0402]
C20  10UF  C-EUC0805  [C0805]
C28  10UF  C-EUC0805  [C0805]
R8  66K5  R-US_R0603  [R0603]
R9  15K  R-US_R0603  [R0603]
R10  1K  R-US_R0402  [R0402]
R11  66K5  R-US_R0603  [R0603]
R12  15K  R-US_R0603  [R0603]
R13  1K  R-US_R0402  [R0402]
R19  66K5  R-US_R0603  [R0603]
R29  15K  R-US_R0603  [R0603]
R30  1K  R-US_R0402  [R0402]
R31  66K5  R-US_R0603  [R0603]
R32  15K  R-US_R0603  [R0603]
R33  1K  R-US_R0402  [R0402]

### Nets
AUDIO_IN_1: C17.1 ; also sheet 2
AUDIO_IN_2: C20.1 ; also sheet 2
AUDIO_IN_3: C5.1 ; also sheet 2
AUDIO_IN_4: C28.1 ; also sheet 2
AUDIO_IN_AMP_LEFT1: C17.2 R8.2
AUDIO_IN_AMP_LEFT2: C5.2 R19.2
CODEC_1_VCOM: C16.2 C19.2 U3.10(C:+IN) U3.12(D:+IN) ; also sheet 1
CODEC_2_VCOM: C4.2 C13.2 U1.10(C:+IN) U1.12(D:+IN) ; also sheet 4
CODEC_IN_1: R10.2 ; also sheet 1
CODEC_IN_2: R13.2 ; also sheet 1
CODEC_IN_3: R30.2 ; also sheet 4
CODEC_IN_4: R33.2 ; also sheet 4
GND: C4.1 C13.1 C16.1 C19.1 ; also sheet 1,2,3,4
N$1: C3.1 R29.1 R30.1 U1.8(C:OUT)
N$2: C3.2 R19.1 R29.2 U1.9(C:-IN)
N$3: C8.1 R32.1 R33.1 U1.14(D:OUT)
N$4: C8.2 R31.1 R32.2 U1.13(D:-IN)
N$5: C28.2 R31.2
N$15: C15.1 R9.1 R10.1 U3.8(C:OUT)
N$16: C15.2 R8.1 R9.2 U3.9(C:-IN)
N$17: C18.1 R12.1 R13.1 U3.14(D:OUT)
N$18: C18.2 R11.1 R12.2 U3.13(D:-IN)
N$19: C20.2 R11.2

### Notes on the sheet
- CODEC Input
- CODEC Input circuit

## Library data of the parts
C1 C2 C4 C9 C10 C12-C14 C16 C19 C27 C36 C40 C43 C47 C48 C51-C53 C58 C59 C62 C66 C67 C70 = Electrosmith-Passives:C-EU: CAPACITOR, European symbol
C3 C8 C11 C15 C18 C21-C26 C30-C35 C39 C41 C44-C46 C71 C74 = Electrosmith-Passives:C-EU: CAPACITOR, European symbol; PACKAGE: C0603
C5-C7 C17 C20 C28 C29 C37 C38 C49 C50 C57 C60 = Electrosmith-Passives:C-EU: CAPACITOR, European symbol; PACKAGE: C0805
D1 D2 D5 D6 = Electrosmith-Semiconductors:DIODE: Diode SMADIODE - SMA Surface Mount Package 20V 1A Schottky Diode Digikey: 641-1014-6-ND DO-1N4148 - Through Hole Small Current Diode SOD-123 20V 1 A (.5mV Vf) Schottky Diode - Digikey: MBRX120TPMSCT-ND SOD-323 10V 570mA (.38mV Vf, 3ns) Schottky Diode - Digikey: ZLLS410CT-ND SOD-523 30V 30mA Schottky Diode (RB751S-40TE61) - Digikey: RB751S-40TE61CT-ND SOT23-R/W - SOT23 Package (R = Solder Paste/Reflow Ovens, W = Hand-Soldering) BAT54Film 40V 300mA - Digikey: 497-7162-1-ND; PACKAGE: SOD-323
ENC_1 = Electrosmith-Interface:ENCODER: ALPS rotary Encoder EC12E series with switch
FB1-FB5 = Electrosmith-Passives:FERRITE_BEAD: SMD EMI Suppression Ferrite Beads - excellent anti-EMI properties - low DCR - impedances till 3000 ohms - rated current up to 6 A
FD1-FD6 = Electrosmith-Connectors:FIDUCIAL: For use by pick and place machines to calibrate the vision/machine, 1mm By microbuilder.eu
J3-J6 J8-J17 = Electrosmith-Interface:EURO_JACK; IPN: Eurorack Jack
J18 J19 = Electrosmith-Interface:STEREO_JACK
L1 = Electrosmith-Passives:INDUCTOR; IPN: 3.3UH 1008 Inductor; MPN: AIML-1008HC-3R3M-T
LOGO1 = Electrosmith-Logo:OSHW-LOGO: Open-Source Hardware (OSHW) Logo This logo indicates the piece of hardware it is found on incorporates a OSHW license and/or adheres to the definition of open source hardware found here: http://freedomdefined.org/OSHW
P1 = Electrosmith-Connectors:EURORACK_POWER; IPN: 2X5 MALE SMT 2.54MM VERTICAL; MANF: FCI; MPN: PH2-10-MTA-SMT-PP-T/R
Q2 = Electrosmith-Semiconductors:NPN: NPN Transistror BF959 corrected 2008.03.06
R1-R9 R11 R12 R14-R29 R31 R32 R34-R45 R50-R55 R57-R59 R61 R62 R64-R67 R71 R72 R87 R89 R90 R93 R110-R118 R121 = Electrosmith-Passives:R-US_: RESISTOR, American symbol; PACKAGE: R0603
R10 R13 R30 R33 R56 R60 R63 R68 R73 R88 R95 R96 R129 R130 = Electrosmith-Passives:R-US_: RESISTOR, American symbol
S1 = Electrosmith-Interface:TAC_SWITCH_SMT: Momentary Switch Button commonly used for reset or general input. Spark Fun Electronics SKU : COM-00097; BIN#: 24-010; IPN: SMT Mini Button; MPN: TL3301SPF160QJ
SW_TOGGLE = Electrosmith-Interface:TOGGLE_ON_OFF_ON
U1 U3 U11 U16 = Electrosmith-IC:TL074: OP AMP; BIN#: 12-011; IPN: TL074 TSSOP-14; MPN: TL074CPWR; PACKAGE: TSSOP-14
U2 = Electrosmith-IC:PCM3060PWR
U4 = Electrosmith-IC:4051: 8-channel ANALOG MULTIPLEXER
U6 = Electrosmith-IC:MCP6004; BIN#: N/A; IPN: MCP6004 TSSOP-14; MPN: MCP6004T-E/ST; PACKAGE: TSSOP-14
U7 = Electrosmith-Interface:MICRO_SD_CARD
U8 = Electrosmith-Power:LM4040-10V: PRECISION MICROPOWER SHUNT VOLTAGE REFERENCE Source: http://focus.ti.com/lit/ds/slcs146e/slcs146e.pdf; IPN: LM4040-10V; MPN: LM4041A12IDBZR; OC_FARNELL: 1407949; OC_NEWARK: 58K5875; PACKAGE: SOT-23
U9 = Electrosmith-Boards:ES_DAISY_SEED2_DFM_REV1
U12 = Electrosmith-Power:ST1S03PUR; COPYRIGHT: Copyright (C) 2021 Ultra Librarian. All rights reserved.; IPN: ST1S03 DFN6D; MFR_NAME: STMicroelectronics; MPN: ST1S03PUR
U14 = Electrosmith-Power:LD1117-*
U15 = Electrosmith-IC:OPTOISOLATOR_H11L1M; MPN: H11L1SR2M
U$5 = Electrosmith-Logo:DAISYLOGO
U_OLED = Electrosmith-Interface:OLED_DISPLAY; IPN: 1.5" Display Module PTH; MPN: ER-OLEDM015-2W-SPI-I2C
VR_1-VR_4 = Electrosmith-Interface:POT_9MM_SNAP-IN_: 9mm vertical snap-in pot, Alpha / Panasonic style; IPN: P-10K-B-R Pointer PIP

## Net classes
0 default: width 0.203 mm
1 USB: width 0.406 mm
8 SAI: width 0.102 mm, drill 0.2 mm